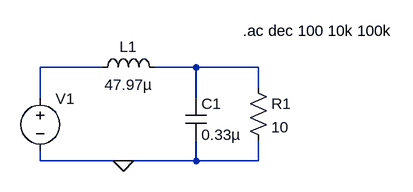
[diagram p0: schematic LAB2.3.3.asc]
LAB2.3.3.asc, the LTspice schematic file:
Version 4
SHEET 1 880 680
WIRE 384 240 288 240
WIRE 528 240 464 240
WIRE 624 240 528 240
WIRE 624 272 624 240
WIRE 288 288 288 240
WIRE 528 288 528 240
WIRE 288 384 288 368
WIRE 416 384 288 384
WIRE 528 384 528 352
WIRE 528 384 416 384
WIRE 624 384 624 352
WIRE 624 384 528 384
FLAG 416 384 0
SYMBOL voltage 288 272 R0
SYMATTR InstName V1
SYMATTR Value ""
SYMATTR Value2 AC 1
SYMBOL ind 368 256 R270
WINDOW 0 32 56 VTop 2
WINDOW 3 5 56 VBottom 2
SYMATTR InstName L1
SYMATTR Value 47.97µ
SYMBOL cap 512 288 R0
SYMATTR InstName C1
SYMATTR Value 0.33µ
SYMBOL Res 608 256 R0
SYMATTR InstName R1
SYMATTR Value 10
TEXT 600 184 Left 2 !.ac dec 100 10k 100k

The netlist it stands for:
* LAB2.3.3.asc
V1 N001 0 AC 1
L1 N001 N002 47.97µ
C1 N002 0 0.33µ
R1 N002 0 10
.ac dec 100 10k 100k
.backanno
.end